# Altium schematic sheet RELAY.SchDoc
size A3; Organization: My Company; Address1: Address Line 1; Address2: Address Line 2; Address3: Address Line 3; Address4: Address Line 4; SheetNumber: 5; SheetTotal: 5
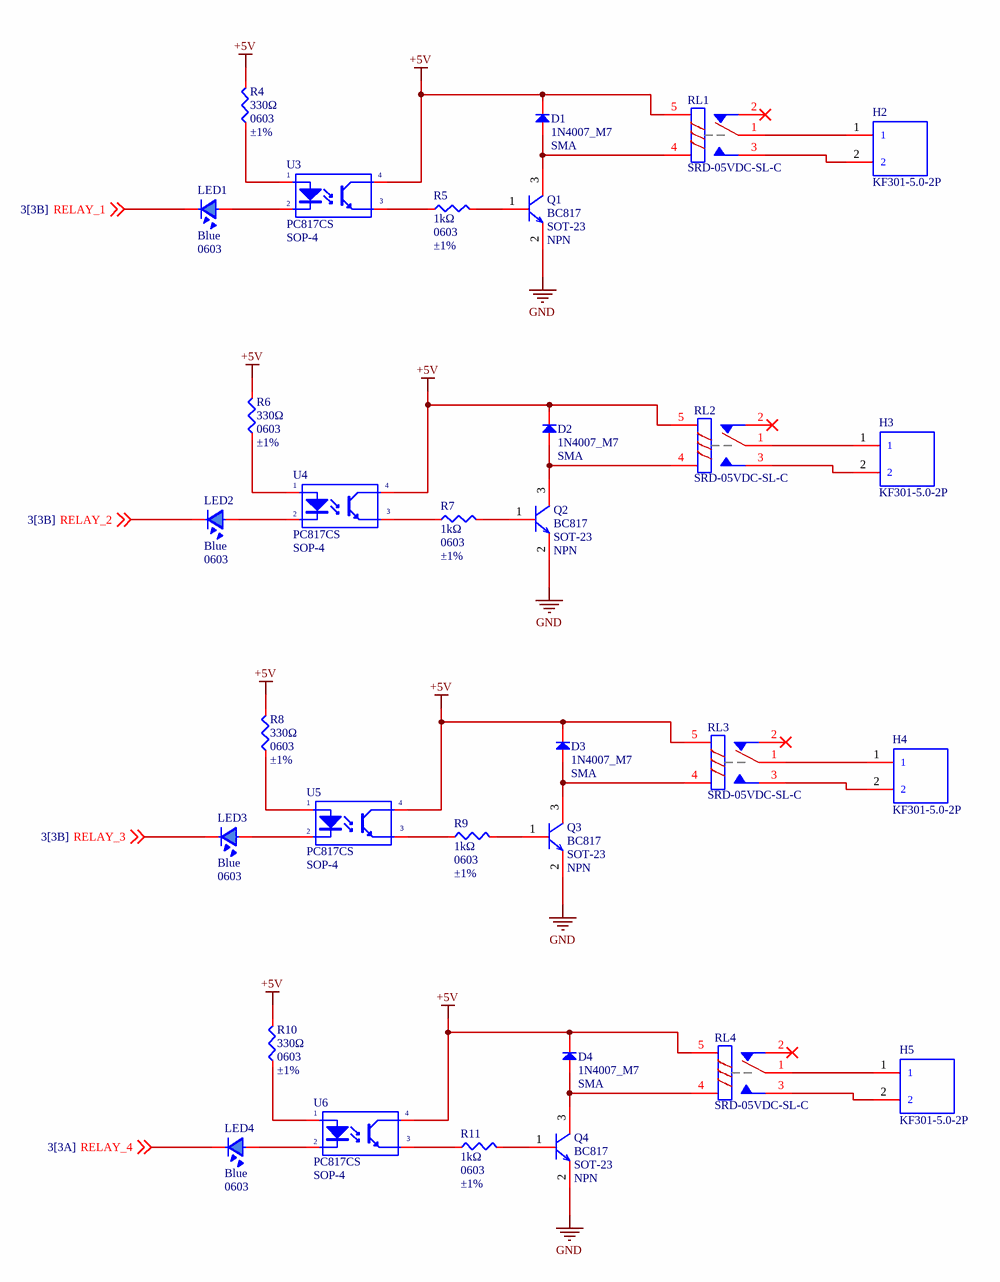
[diagram p0: RELAY.SchDoc]

## Parts
D1  1N4007_M7  Package: SMA  [SMA(DO-214AC)]
D2  1N4007_M7  Package: SMA  [SMA(DO-214AC)]
D3  1N4007_M7  Package: SMA  [SMA(DO-214AC)]
D4  1N4007_M7  Package: SMA  [SMA(DO-214AC)]
H2  KF301-5.0-2P  [CONN-TH_P5.00_KF301-5.0-2P]
H3  KF301-5.0-2P  [CONN-TH_P5.00_KF301-5.0-2P]
H4  KF301-5.0-2P  [CONN-TH_P5.00_KF301-5.0-2P]
H5  KF301-5.0-2P  [CONN-TH_P5.00_KF301-5.0-2P]
LED1  Blue  Package: 0603  [LED0603_BLUE]
LED2  Blue  Package: 0603  [LED0603_BLUE]
LED3  Blue  Package: 0603  [LED0603_BLUE]
LED4  Blue  Package: 0603  [LED0603_BLUE]
Q1  BC817  Type: NPN  [SOT-23]
Q2  BC817  Type: NPN  [SOT-23]
Q3  BC817  Type: NPN  [SOT-23]
Q4  BC817  Type: NPN  [SOT-23]
R4  330Ω  Package: 0603  Tolerance: ±1%  [R0603]
R5  1kΩ  Package: 0603  Tolerance: ±1%  [R0603]
R6  330Ω  Package: 0603  Tolerance: ±1%  [R0603]
R7  1kΩ  Package: 0603  Tolerance: ±1%  [R0603]
R8  330Ω  Package: 0603  Tolerance: ±1%  [R0603]
R9  1kΩ  Package: 0603  Tolerance: ±1%  [R0603]
R10  330Ω  Package: 0603  Tolerance: ±1%  [R0603]
R11  1kΩ  Package: 0603  Tolerance: ±1%  [R0603]
RL1  SRD-05VDC-SL-C  [Through Hole,15.6x19.2mm]
RL2  SRD-05VDC-SL-C  [Through Hole,15.6x19.2mm]
RL3  SRD-05VDC-SL-C  [Through Hole,15.6x19.2mm]
RL4  SRD-05VDC-SL-C  [Through Hole,15.6x19.2mm]
U3  PC817CS  [SOP-4]
U4  PC817CS  [SOP-4]
U5  PC817CS  [SOP-4]
U6  PC817CS  [SOP-4]

## Nets
+5V: D1.1 D2.1 D3.1 D4.1 R4.2 R6.2 R8.2 R10.2 RL1.5 RL2.5 RL3.5 RL4.5 U3.4(C) U4.4(C) U5.4(C) U6.4(C)
GND: Q1.2(E) Q2.2(E) Q3.2(E) Q4.2(E)
RELAY_1: LED1.2 ; off-sheet RELAY_1
RELAY_2: LED2.2 ; off-sheet RELAY_2
RELAY_3: LED3.2 ; off-sheet RELAY_3
RELAY_4: LED4.2 ; off-sheet RELAY_4
NetD1_2: D1.2 Q1.3(C) RL1.4
NetD2_2: D2.2 Q2.3(C) RL2.4
NetD3_2: D3.2 Q3.3(C) RL3.4
NetD4_2: D4.2 Q4.3(C) RL4.4
NetH2_1: H2.1 RL1.1
NetH2_2: H2.2 RL1.3
NetH3_1: H3.1 RL2.1
NetH3_2: H3.2 RL2.3
NetH4_1: H4.1 RL3.1
NetH4_2: H4.2 RL3.3
NetH5_1: H5.1 RL4.1
NetH5_2: H5.2 RL4.3
NetLED1_1: LED1.1 U3.2(K)
NetLED2_1: LED2.1 U4.2(K)
NetLED3_1: LED3.1 U5.2(K)
NetLED4_1: LED4.1 U6.2(K)
NetQ1_1: Q1.1(B) R5.2
NetQ2_1: Q2.1(B) R7.2
NetQ3_1: Q3.1(B) R9.2
NetQ4_1: Q4.1(B) R11.2
NetR4_1: R4.1 U3.1(A)
NetR5_1: R5.1 U3.3(E)
NetR6_1: R6.1 U4.1(A)
NetR7_1: R7.1 U4.3(E)
NetR8_1: R8.1 U5.1(A)
NetR9_1: R9.1 U5.3(E)
NetR10_1: R10.1 U6.1(A)
NetR11_1: R11.1 U6.3(E)

Not connected (* = marked no-connect by the designer): RL1 2*; RL2 2*; RL3 2*; RL4 2*

## Notes on the sheet
- Author:
- Title:
- Size:
- A3
- Project:
- Revision:
- Modified Date:
- CheckedBy:
- Date:
- SW Version:

## Library data of the parts
D1-D4 = 1N4007_M7: 1A 1V@1A 1kV SMA Diodes - General Purpose ROHS; Manufacturer: JSMSEMI; Mfr. Part: 1N4007 M7; LCSC Part: C20754788; Link: https://www.lcsc.com/product-detail/C20754788.html?s_z=n_1N4007
H2-H5 = KF301-5.0-2P: 1x2P -30℃~+120℃ 17A 250V Blue 14~22 Through Hole 5mm 1.5 1 2 Through Hole,P=5mm Screw Terminal Blocks ROHS; Manufacturer: Cixi Kefa Elec; Mfr. Part: KF301-5.0-2P; LCSC Part: C474881; Package: Through Hole,P=5mm; Category: Connectors/Screw Terminal Blocks; Color: Blue; Link: https://www.lcsc.com/product-detail/C474881.html
LED1-LED4 = LED0603_Blue: 2mA 24mcd Water Clear -40℃~+85℃ 470nm Blue 130° 120mW 2.65V 0603 LED Indication - Discrete ROHS; Manufacturer: Kingbright; Mfr. Part: APT1608LVBC/D; Key Attributes: 1.6 x 0.8 mm SMD Chip LED Lamp; LCSC Part: C5200747; Illumination Color: Blue; Power(Watts): 120mW; Voltage - Forward(Vf): 2.65V; Forward Current: 2mA; Operating Temperature: -40℃~+85℃; Link: https://www.lcsc.com/product-detail/C5200747.html
Q1-Q4 = BC817: 345mW 45V 250@100mA,1V 500mA NPN SOT-23 Single Bipolar Transistors ROHS; Manufacturer: Nexperia; Mfr. Part: BC817-40,215; Transition frequency(fT): 100MHz; Vce Saturation(VCE(sat)): 700mV; LCSC Part: C52801; Pd - Power Dissipation: 345mW; Operating Temperature: -65℃~+150℃; Current - Collector(Ic): 500mA; Link: https://www.lcsc.com/product-detail/C52801.html?s_z=n_NPN; Category: BJT; Package: SOT-23
R4 R6 R8 R10 = R0603_330Ω_±1%: 100mW Thick Film Resistor 75V ±100ppm/℃ ±1% 330Ω 0603 Chip Resistor - Surface Mount ROHS; Manufacturer: YAGEO; Mfr. Part: RC0603FR-07330RL; LCSC Part: C105881; Resistance: 330Ω; Operating Temperature: -55℃~+155℃; Link: https://www.lcsc.com/product-detail/C105881.html
R5 R7 R9 R11 = R0603_1kΩ_±1%: 100mW Thick Film Resistor 75V ±100ppm/℃ ±1% 1kΩ 0603 Chip Resistor - Surface Mount ROHS; Manufacturer: YAGEO; Mfr. Part: RC0603FR-071KL; LCSC Part: C22548; Resistance: 1kΩ; Operating Temperature: -55℃~+155℃; Link: https://www.lcsc.com/product-detail/C22548.html
RL1-RL4 = SRD-05VDC-SL-C: 250V@AC 5V 15A 1 Form C: 1C (SPDT-CO) Through Hole,15.6x19.2mm Power Relays ROHS; Manufacturer: Songle Relay; Mfr. Part: SRD-05VDC-SL-C; LCSC Part: C35449; Package: Through Hole,15.6x19.2mm; Switching Voltage(Max): 250V@AC; Coil Voltage: 5V; Switching Current(Max): 15A; Number of Pins: 5; Link: https://www.lcsc.com/product-detail/C35449.html?s_z=n_relay
U3-U6 = PC817CS: 50mA 200mV@1mA,20mA 80V 6V 1.2V DC SOP-4 Transistor, Photovoltaic Output Optoisolators ROHS; Manufacturer: AOTE; Key Attributes: OPTOISOLATOR 5kV 1CH TRANS SOP-4; Mfr. Part: PC817CS; LCSC Part: C20612591; Category: Isolators/Optocouplers, Optoisolators/Transistor, Photovoltaic Output Optoisolators; Link: https://www.lcsc.com/product-detail/C20612591.html?s_z=n_pc817; Package: SOP-4